# Altium project Quadcopter Fligth Controller Board.PrjPcb (part 7 of 7)
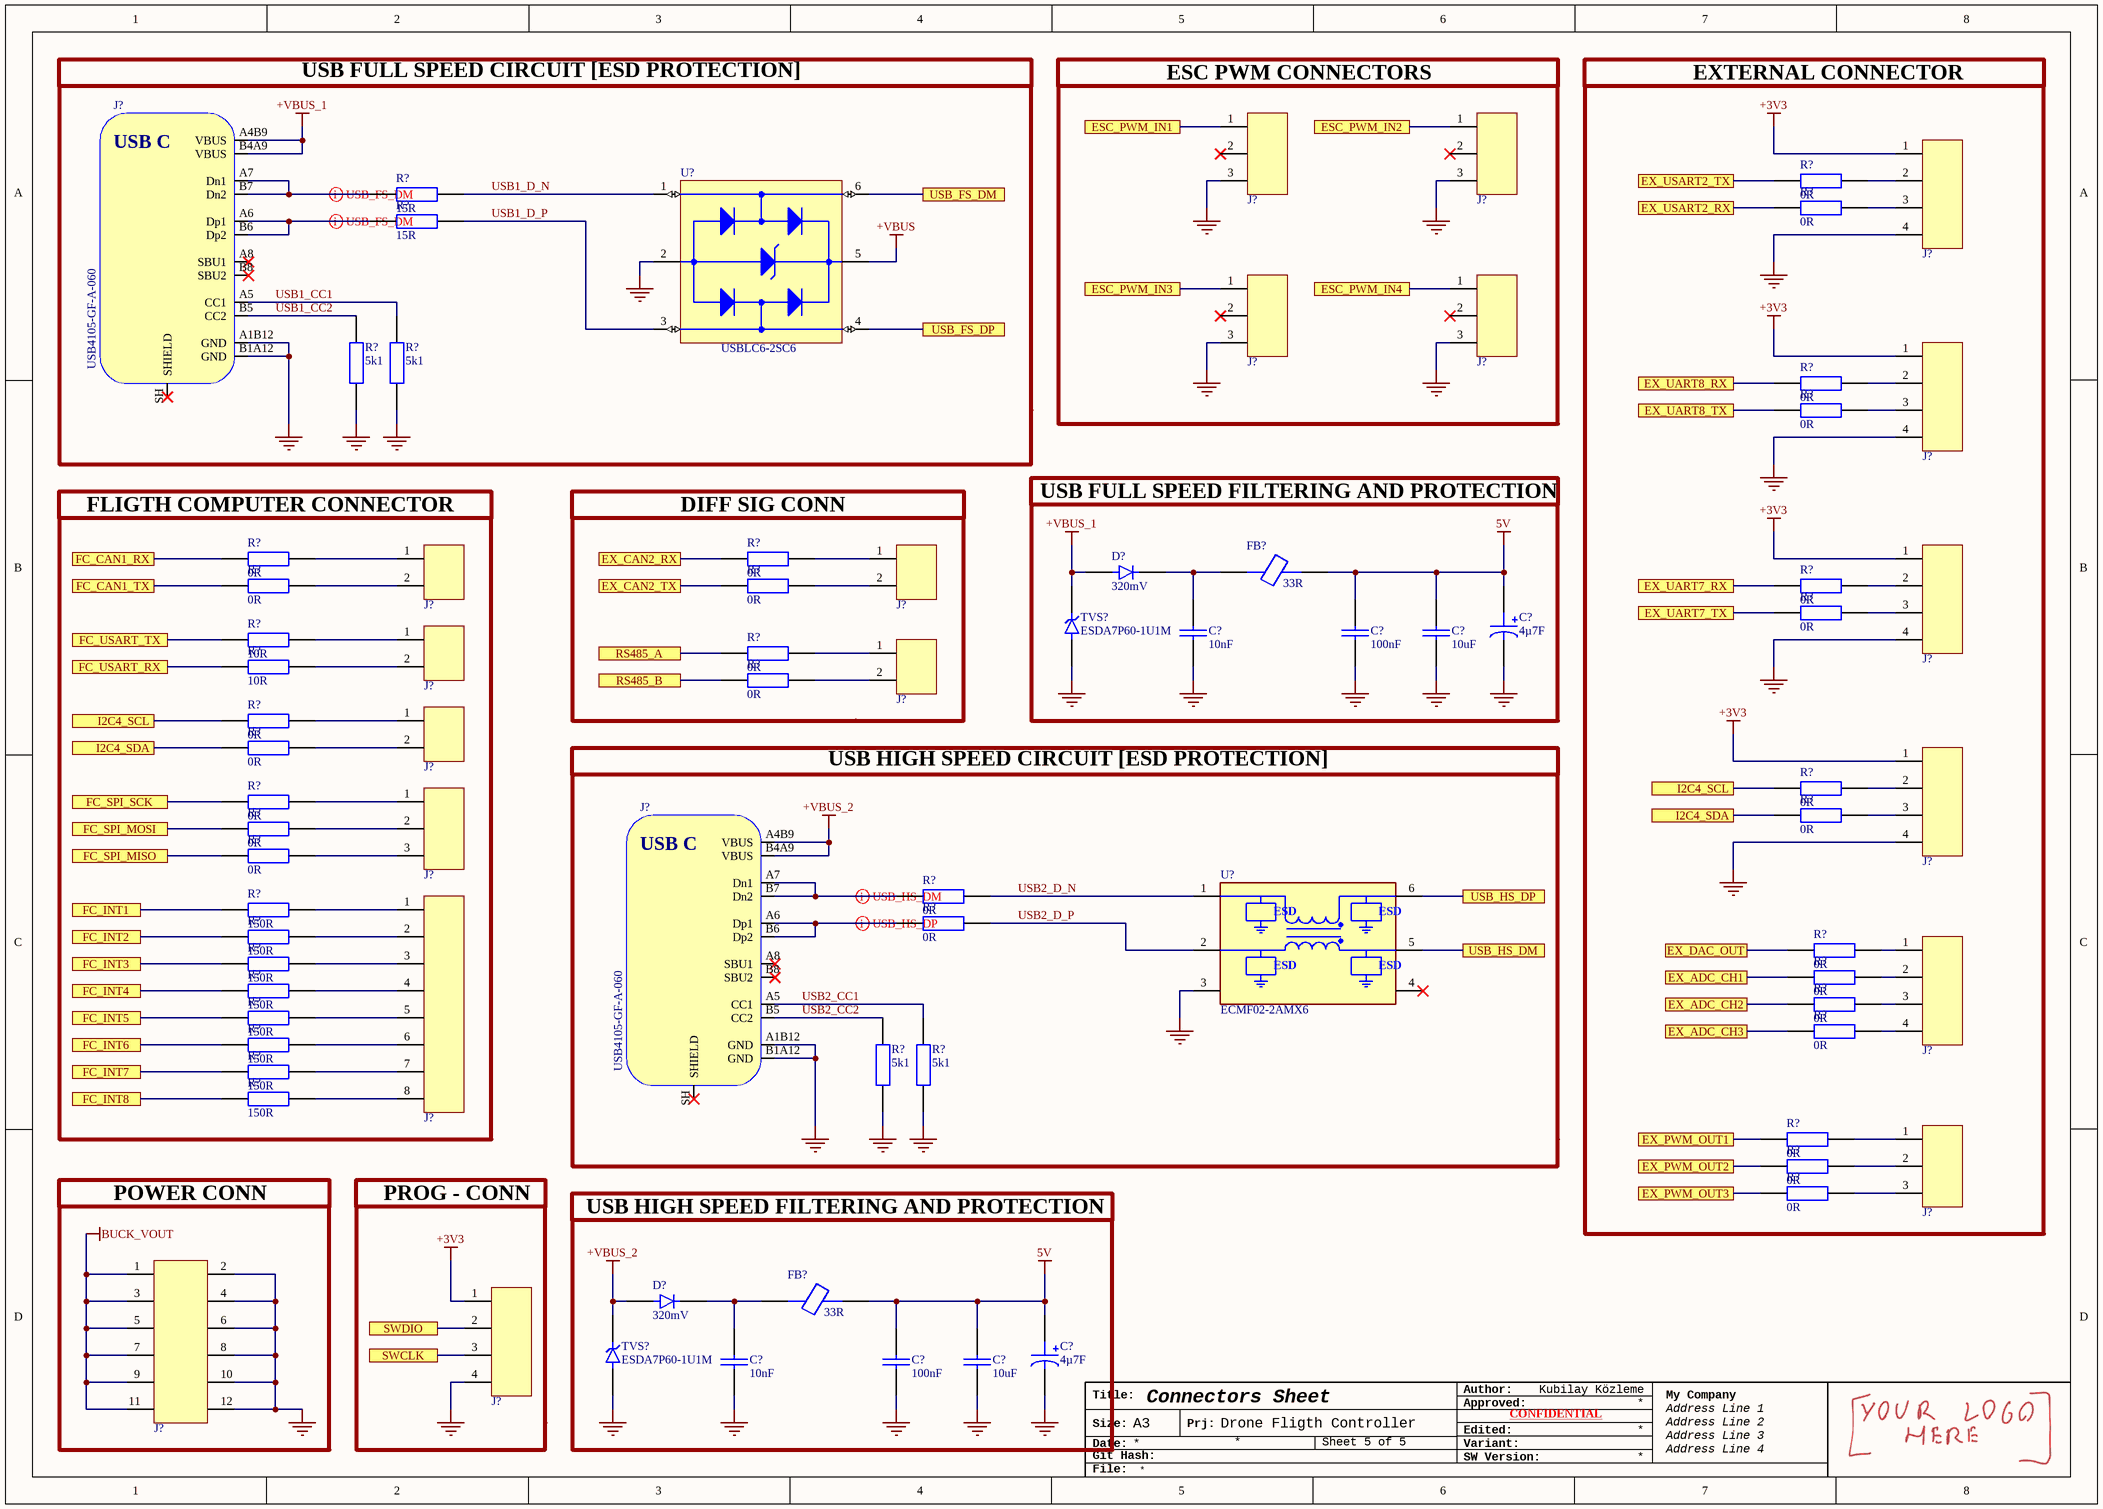
[diagram p7: Connector.SchDoc]

## Nets that join several sheets
3V3: Power (6 pins), Microcontroller (24 pins)
5V: Microcontroller (BZ?.1 D?#6.1 R?#29.1), Connector (8 pins)
11.1V: Power (R?#1.1), Peripherals (U?#9.1)
+3V3: Microcontroller (8 pins), Peripherals (31 pins), Connector (5 pins)
BUCK_GND1: Power (34 pins), Microcontroller (33 pins), Peripherals (33 pins), Connector (35 pins)
BUCK_VOUT: Power (13 pins), Connector (6 pins)
VIN_EMI: Power (FB?#1.1 R?#1.2), Peripherals (U?#9.2)
NetJ?#2_1: Microcontroller (U?#3.95), Connector (J?#2.1)
NetJ?#3_1: Microcontroller (U?#3.23), Connector (J?#3.1)
NetJ?#5_1: Microcontroller (U?#3.65), Connector (J?#5.1)
NetJ?#6_1: Microcontroller (U?#3.39), Connector (J?#6.1)
NetJ?#21_2: Microcontroller (U?#3.72), Connector (J?#21.2)
NetJ?#21_3: Microcontroller (U?#3.76), Connector (J?#21.3)
NetR?#13_1: Microcontroller (R?#13.1 U?#3.93), Peripherals (U?#5.9)
NetR?#14_1: Microcontroller (R?#14.1 U?#3.92), Peripherals (U?#5.8)
NetR?#15_1: Microcontroller (R?#15.1 U?#3.47), Peripherals (U?#8.4)
NetR?#16_1: Microcontroller (R?#16.1 U?#3.46), Peripherals (U?#8.2)
NetR?#17_1: Microcontroller (R?#17.1 U?#3.66), Peripherals (U?#6.4 U?#9.6)
NetR?#18_1: Microcontroller (R?#18.1 U?#3.67), Peripherals (U?#6.1 U?#9.5)
NetR?#19_1: Microcontroller (R?#19.1 U?#3.60), Connector (R?#49.1 R?#52.1)
NetR?#20_1: Microcontroller (R?#20.1 U?#3.59), Connector (R?#48.1 R?#50.1)
NetR?#30_1: Microcontroller (U?#3.86), Connector (R?#30.1)
NetR?#32_1: Microcontroller (U?#3.87), Connector (R?#32.1)
NetR?#34_1: Microcontroller (U?#3.97), Connector (R?#34.1)
NetR?#37_1: Microcontroller (U?#3.98), Connector (R?#37.1)
NetR?#38_1: Microcontroller (U?#3.81), Connector (R?#38.1)
NetR?#39_1: Microcontroller (U?#3.51), Connector (R?#39.1)
NetR?#40_1: Microcontroller (U?#3.82), Connector (R?#40.1)
NetR?#41_1: Microcontroller (U?#3.52), Connector (R?#41.1)
NetR?#42_1: Microcontroller (U?#3.37), Connector (R?#42.1)
NetR?#43_1: Microcontroller (U?#3.38), Connector (R?#43.1)
NetR?#44_1: Microcontroller (U?#3.63), Connector (R?#44.1)
NetR?#46_1: Microcontroller (U?#3.64), Connector (R?#46.1)
NetR?#51_1: Microcontroller (U?#3.78), Connector (R?#51.1)
NetR?#53_1: Microcontroller (U?#3.80), Connector (R?#53.1)
NetR?#54_1: Microcontroller (U?#3.79), Connector (R?#54.1)
NetR?#56_1: Microcontroller (U?#3.40), Connector (R?#56.1)
NetR?#58_1: Microcontroller (U?#3.41), Connector (R?#58.1)
NetR?#59_1: Microcontroller (U?#3.28), Connector (R?#59.1)
NetR?#60_1: Microcontroller (U?#3.42), Connector (R?#60.1)
NetR?#61_1: Microcontroller (U?#3.24), Connector (R?#61.1)
NetR?#62_1: Microcontroller (U?#3.43), Connector (R?#62.1)
NetR?#63_1: Microcontroller (U?#3.25), Connector (R?#63.1)
NetR?#64_1: Microcontroller (U?#3.44), Connector (R?#64.1)
NetR?#65_1: Microcontroller (U?#3.35), Connector (R?#65.1)
NetR?#66_1: Microcontroller (U?#3.83), Connector (R?#66.1)
NetR?#67_1: Microcontroller (U?#3.84), Connector (R?#67.1)
NetR?#68_1: Microcontroller (U?#3.85), Connector (R?#68.1)
NetR?#71_1: Microcontroller (U?#3.96), Connector (R?#71.1)
NetR?#72_1: Microcontroller (U?#3.77), Connector (R?#72.1)
NetR?#73_1: Microcontroller (U?#3.69), Connector (R?#73.1)
NetU?#3_1: Microcontroller (U?#3.1), Peripherals (U?#11.2)
NetU?#3_2: Microcontroller (U?#3.2), Peripherals (U?#11.3)
NetU?#3_3: Microcontroller (U?#3.3), Peripherals (U?#11.4)
NetU?#3_4: Microcontroller (U?#3.4), Peripherals (U?#11.8)
NetU?#3_5: Microcontroller (U?#3.5), Peripherals (U?#11.1)
NetU?#3_7: Microcontroller (U?#3.7), Peripherals (U?#11.5)
NetU?#3_29: Microcontroller (U?#3.29), Peripherals (U?#10.6)
NetU?#3_30: Microcontroller (U?#3.30), Peripherals (U?#10.2)
NetU?#3_31: Microcontroller (U?#3.31), Peripherals (U?#10.5)
NetU?#3_32: Microcontroller (U?#3.32), Peripherals (U?#10.7)
NetU?#3_33: Microcontroller (U?#3.33), Peripherals (U?#10.3)
NetU?#3_34: Microcontroller (U?#3.34), Peripherals (U?#10.1)
NetU?#3_45: Microcontroller (U?#3.45), Peripherals (U?#8.7)
NetU?#3_53: Microcontroller (U?#3.53), Connector (U?#16.5)
NetU?#3_54: Microcontroller (U?#3.54), Connector (U?#16.6)
NetU?#3_68: Microcontroller (U?#3.68), Peripherals (U?#6.7)
NetU?#3_70: Microcontroller (U?#3.70), Connector (U?#15.6)
NetU?#3_71: Microcontroller (U?#3.71), Connector (U?#15.4)
NetU?#3_88: Microcontroller (U?#3.88), Peripherals (U?#5.13)
NetU?#3_89: Microcontroller (U?#3.89), Peripherals (U?#5.12)
NetU?#3_90: Microcontroller (U?#3.90), Peripherals (U?#5.1)
NetU?#3_91: Microcontroller (U?#3.91), Peripherals (U?#5.16)